# Altium schematic sheet POWER.SchDoc
size A4; CheckedBy: Danny.Wu; DrawnBy: Vae.Liu; Revision: V1.2; Code: SMART-EVB-G2
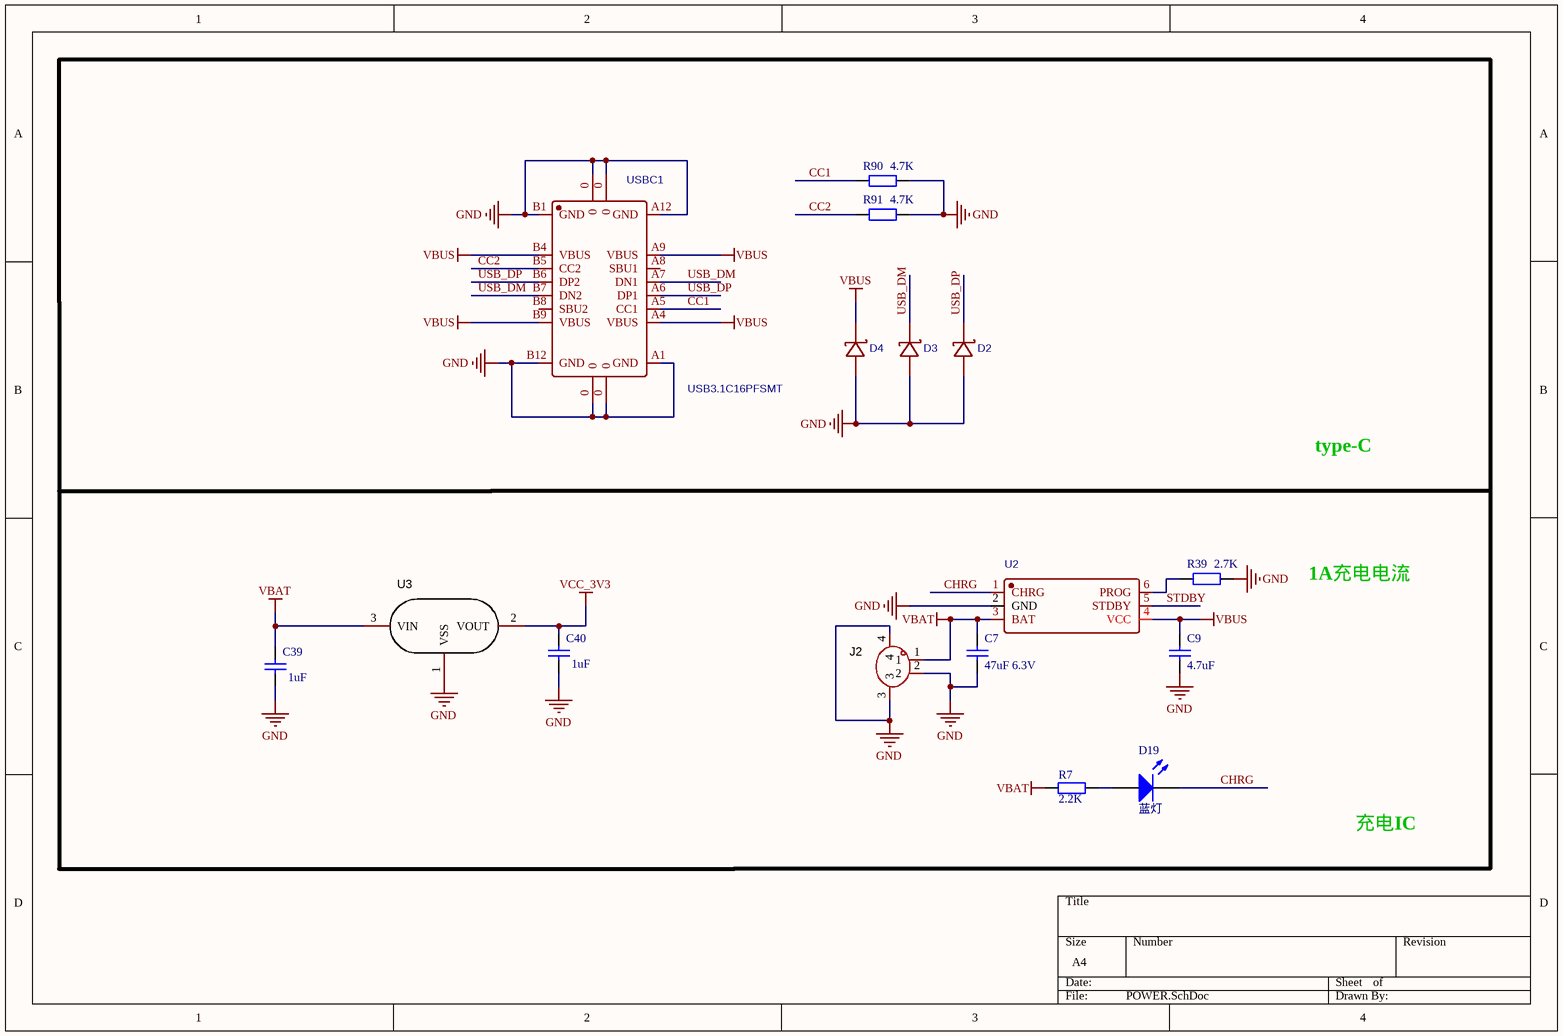
[diagram p0: POWER.SchDoc]

## Parts
C7  47uF 6.3V  [0805C]
C9  4.7uF  [0402C]
C39  1uF  [0402C]
C40  1uF  [0402C]
D2  LESD8LL5.0T5G  [SOD-882_L1.0-W0.6-RD]  (value not drawn)
D3  LESD8LL5.0T5G  [SOD-882_L1.0-W0.6-RD]  (value not drawn)
D4  LESD8LL5.0T5G  [SOD-882_L1.0-W0.6-RD]  (value not drawn)
D19  value 蓝灯  [LED-0603_RD]  (hidden comment: XL-2012UBC)
J2  WAFER-MX1.25-2PWB  [CONN-SMD_2P-P1.25_XUNPU_WAFER-MX1.25-2PWB]  (value not drawn)
R7  2.2K  [0402R]
R39  2.7K  [0402R]
R90  4.7K  [0402R]
R91  4.7K  [0402R]
U2  ME4055AM6G-N  [SOT-23-6PIN]  (value not drawn)
U3  XC6206P332MR  [SOT-23]  (value not drawn)
USBC1  USB3.1C16PFSMT  [USB-C-SMD_TYPE-C-USB-17]

## Nets
GND: C7.1 C9.1 C39.1 C40.1 D2.2(A) D3.2(A) D4.2(A) J2.2 J2.3 J2.4 R39.2 R90.2 R91.2 U2.2(GND) U3.1(VSS) USBC1.0 USBC1.A1(GND) USBC1.A12(GND) USBC1.B1(GND) USBC1.B12(GND)
VBAT: C7.2 C39.2 J2.1 R7.2 U2.3(BAT) U3.3(VIN)
VBUS: C9.2 D4.1(C) U2.4(VCC) USBC1.A4(VBUS) USBC1.A9(VBUS) USBC1.B4(VBUS) USBC1.B9(VBUS)
VCC_3V3: C40.2 U3.2(VOUT)
CC1: R90.1 USBC1.A5(CC1)
CC2: R91.1 USBC1.B5(CC2)
CHRG: D19.2(K) U2.1(CHRG)
STDBY: U2.5(STDBY)
USB_DM: D3.1(C) USBC1.A7(DN1) USBC1.B7(DN2)
USB_DP: D2.1(C) USBC1.A6(DP1) USBC1.B6(DP2)
NetD19_1: D19.1(A) R7.1
NetR39_1: R39.1 U2.6(PROG)

Not connected (* = marked no-connect by the designer): USBC1 A8(SBU1) B8(SBU2)

## Notes on the sheet
- type-C
- 1A充电电流
- 充电IC

## Library data of the parts
C7 C9 = Cap: Capacitor; Value: 1uF; Published: 8-Jun-2000; LatestRevisionDate: 17-Jul-2002; LatestRevisionNote: Re-released for DXP Platform.; PackageReference: RAD-0.3; Publisher: Altium Limited
C39 C40 = Cap: Capacitor; Published: 8-Jun-2000; LatestRevisionDate: 17-Jul-2002; LatestRevisionNote: Re-released for DXP Platform.; PackageReference: RAD-0.3; Publisher: Altium Limited; Value: 1uF
D2-D4 = LESD8LL5.0T5G: ESD; BOM_Manufacturer: LRC; Contributor: LCSC; BOM_Supplier Part: C172423; BOM_Supplier: LCSC; BOM_Manufacturer Part: LESD8LL5.0T5G; BOM_JLCPCB Part Class: Extended Part; spicePre: D; spiceSymbolName: LESD8LL5.0T5G
D19 = LED0: Typical INFRARED GaAs LED; Published: 8-Jun-2000; LatestRevisionDate: 08-Jul-2005; LatestRevisionNote: Mech Layer 1 removed.; PackageReference: LED-0; Publisher: Altium Limited
J2 = WAFER-MX1.25-2PWB: WAFER; Manufacturer: XUNPU(讯普); Add into BOM: yes; Pins Structure: 1x2P; Pitch: 1.25mm; Reference Series: PicoBlade(MX 1.25); Number of PINs Per Row: 2; Current Rating: 1A; Voltage Rating: 125V; Plastic Material: LCP; Supplementary Features: 辅助焊脚; Z-Height of the Board: 3.6mm; X-Length of Bottom Edge on Board (Spacing Line): 7.5mm; Y-Width of Bottom Edge on Board: 5.25mm; Symbol: WAFER-MX1.25-2PWB; Device: WAFER-MX1.25-2PWB; LCSC Part Name: 1x2P 间距:1.25mm 卧贴 系列:PicoBlade(MX 1.25); Supplier Part: C3029359; Manufacturer Part: WAFER-MX1.25-2PWB; Supplier Footprint: SMD,P=1.25mm,卧贴; JLCPCB Part Class: Extended Part; Datasheet: https://atta.szlcsc.com/upload/public/pdf/source/20220527/5ACBB683E384B6AD06743F272F933620.pdf; Supplier: LCSC; Convert to PCB: yes; Mounting Type: 卧贴; Number of Pins: 2P; Number of Rows: 1; Row Spacing: -; Contact Material: 黄铜; Contact Plating: -; Operating Temperature: -25℃~+85℃; Flame Retardant Rating: -; Color: 米色
R7 R39 R90 R91 = Res2: Resistor; Published: 8-Jun-2000; LatestRevisionDate: 17-Jul-2002; LatestRevisionNote: Re-released for DXP Platform.; PackageReference: AXIAL-0.4; Publisher: Altium Limited
U2 = HX4057A: 充电IC; BOM_Manufacturer: MICRONE(南京微盟); Contributor: LCSC; SMT Type: Extend; BOM_Supplier: LCSC; BOM_Supplier Part: C82121; BOM_Manufacturer Part: ME4055AM6G-N; BOM_LCSC Assembly: Yes; spicePre: U; spiceSymbolName: ME4055AM6G-N
U3 = ME6203A50M3G: LDO; Manufacturer: MICRONE(南京微盟); Add into BOM: yes; Output Type: 固定; Output Polarity: 正; Number of Outputs: 1; Maximum Input Voltage: 40V; Output Voltage: 5V; Dropout Voltage: 680mV@(50mA); Output Current: 180mA; Name: ME6203A50M3G; Symbol: XC6206P332MR; Device: XC6206P332MR; LCSC Part Name: XC6206P332MR; Supplier Part: C347376; Manufacturer Part: ME6203A50M3G; Supplier Footprint: SOT-23; JLCPCB Part Class: Extended Part; Datasheet: https://atta.szlcsc.com/upload/public/pdf/source/20170622/1498103883286.pdf; Supplier: LCSC; Convert to PCB: yes; Power Supply Rejection Ratio (PSRR): -
USBC1 = USB3.1C16PFSMT: USBC; BOM_Manufacturer: LCSC; BOM_Supplier: LCSC; BOM_Supplier Part: C167321; BOM_Manufacturer Part: -; Contributor: LCSC; spicePre: U; spiceSymbolName: USB3.1C16PFSMT